# EAGLE design Xbee_shield_v15 (EAGLE 7.4.0)
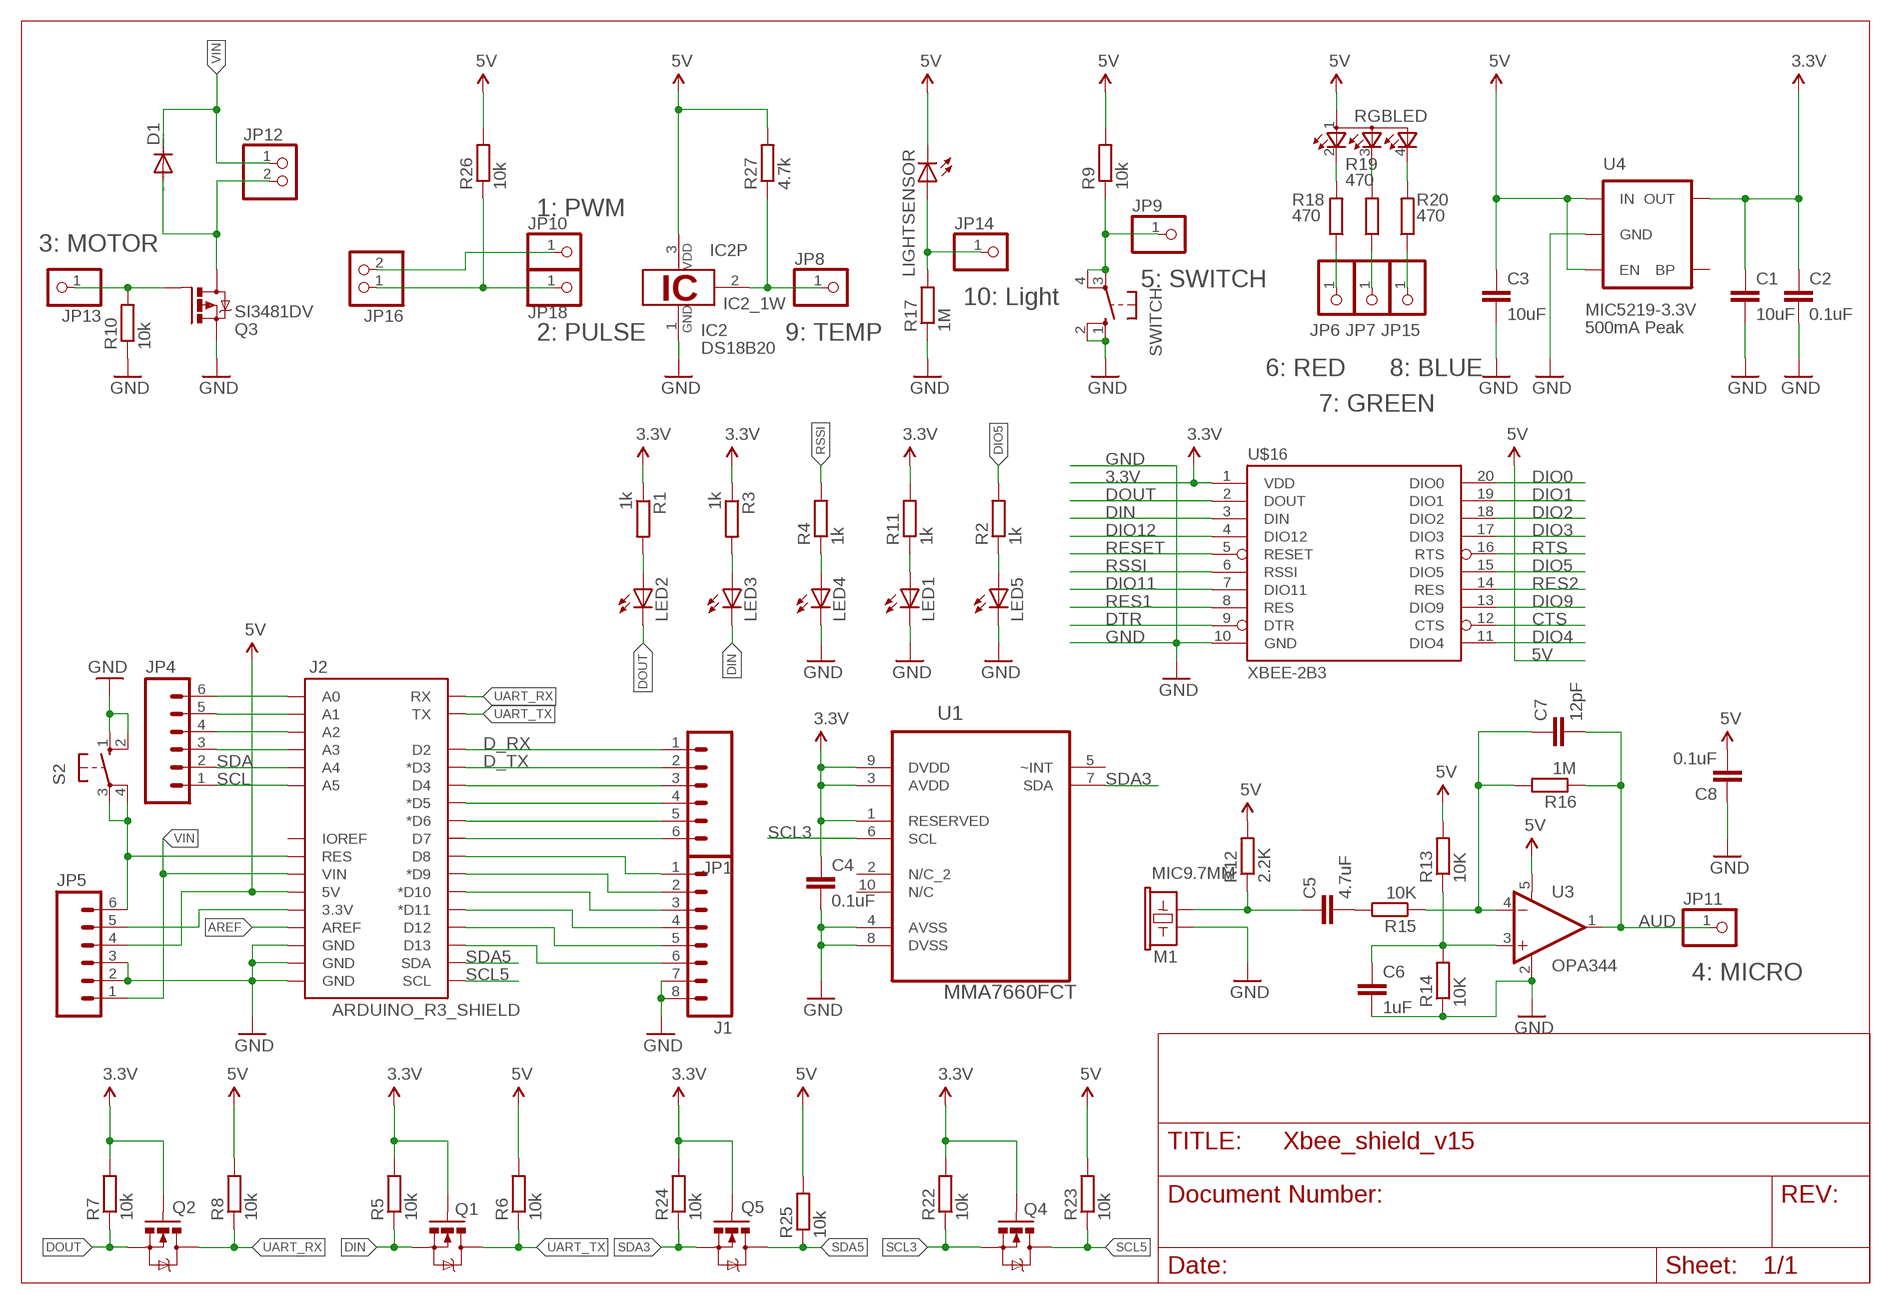
[diagram p0: schematic, sheet 1]

## Parts
C1  10uF  C-EUC0805  [C0805]
C2  0.1uF  C-EUC0805  [C0805]
C3  10uF  C-EUC0805  [C0805]
C4  0.1uF  C-EUC0805  [C0805]
C5  4.7uF  C-EUC0805  [C0805]
C6  1uF  C-EUC0805  [C0805]
C7  12pF  C-EUC0805  [C0805]
C8  0.1uF  C-EUC0805  [C0805]
D1  DIODE-DO214AA  [DO214AA]
IC2  DS18B20  [TO92-]
J1  M08  [1X08_ROUND]
J2  ARDUINO_R3_SHIELD  [UNO_R3_SHIELD]
JP1  M06SIP  [1X06]
JP4  M06SIP  [1X06]
JP5  M06SIP  [1X06]
JP6  PINHD-1X1  [1X01]
JP7  PINHD-1X1  [1X01]
JP8  PINHD-1X1  [1X01]
JP9  PINHD-1X1  [1X01]
JP10  PINHD-1X1  [1X01]
JP11  PINHD-1X1  [1X01]
JP12  PINHD-1X2  [1X02]
JP13  PINHD-1X1  [1X01]
JP14  PINHD-1X1  [1X01]
JP15  PINHD-1X1  [1X01]
JP16  PINHD-1X2  [1X02]
JP18  PINHD-1X1  [1X01]
LED1  LEDCHIPLED_0805  [CHIPLED_0805]
LED2  LEDCHIPLED_0805  [CHIPLED_0805]
LED3  LEDCHIPLED_0805  [CHIPLED_0805]
LED4  LEDCHIPLED_0805  [CHIPLED_0805]
LED5  LEDCHIPLED_0805  [CHIPLED_0805]
LIGHTSENSOR  LED5MM  [LED5MM]
M1  MIC9.7MM  [MIC-9.7MM]
Q1  MOSFET-NCHANNELSMD  [SOT23-3]
Q2  MOSFET-NCHANNELSMD  [SOT23-3]
Q3  SI3481DV  [TSOP-6.PAC]
Q4  MOSFET-NCHANNELSMD  [SOT23-3]
Q5  MOSFET-NCHANNELSMD  [SOT23-3]
R1  1k  R-EU_R0805  [R0805]
R2  1k  R-EU_R0805  [R0805]
R3  1k  R-EU_R0805  [R0805]
R4  1k  R-EU_R0805  [R0805]
R5  10k  R-EU_R0805  [R0805]
R6  10k  R-EU_R0805  [R0805]
R7  10k  R-EU_R0805  [R0805]
R8  10k  R-EU_R0805  [R0805]
R9  10k  R-EU_R0805  [R0805]
R10  10k  R-EU_R0805  [R0805]
R11  1k  R-EU_R0805  [R0805]
R12  2.2K  R-EU_R0805  [R0805]
R13  10K  R-EU_R0805  [R0805]
R14  10K  R-EU_R0805  [R0805]
R15  10K  R-EU_R0805  [R0805]
R16  1M  R-EU_R0805  [R0805]
R17  1M  R-EU_R0805  [R0805]
R18  470  R-EU_R0805  [R0805]
R19  470  R-EU_R0805  [R0805]
R20  470  R-EU_R0805  [R0805]
R22  10k  R-EU_R0805  [R0805]
R23  10k  R-EU_R0805  [R0805]
R24  10k  R-EU_R0805  [R0805]
R25  10k  R-EU_R0805  [R0805]
R26  10k  R-EU_R0805  [R0805]
R27  4.7k  R-EU_R0805  [R0805]
RGBLED  TOPLED-3  [P-LCC-4-3]
S2  10-XX  [B3F-10XX]
SWITCH  10-XX  [B3F-10XX]
U1  MMA7660FCT  [DFN300X300X100-10N]
U3  OPA344  [SOT23-5]
U4  V_REG_LDOSMD  [SOT23-5]
U$16  XBEE-2B3  [XBEE-SMD]

## Nets
3.3V: C1.1 C2.1 C4.1 Q1.1(G) Q2.1(G) Q4.1(G) Q5.1(G) R1.1 R3.1 R5.2 R7.2 R11.2 R22.2 R24.2 U1.1(RESERVED) U1.3(AVDD) U1.9(DVDD) U4.5(OUT) U$16.1(VDD)
5V: C3.1 C8.2 IC2.3 J2.5V JP5.4 LIGHTSENSOR.K(C) R6.2 R8.2 R9.2 R12.2 R13.2 R23.2 R25.2 R26.2 R27.2 RGBLED.1(A2) U3.5(V+) U4.1(IN) U4.3(EN)
AREF: J2.AREF
AUD: C7.2 JP11.1 R16.1 U3.1(OUT)
CTS: U$16.12(CTS)
D_RX: J2.D2 JP1.1
D_TX: J2.D3(*D3) JP1.2
DIN: LED3.C Q1.2(S) R5.1 U$16.3(DIN)
DIO0: U$16.20(DIO0)
DIO1: U$16.19(DIO1)
DIO2: U$16.18(DIO2)
DIO3: U$16.17(DIO3)
DIO4: U$16.11(DIO4)
DIO5: R2.2 U$16.15(DIO5)
DIO9: U$16.13(DIO9)
DIO11: U$16.7(DIO11)
DIO12: U$16.4(DIO12)
DOUT: LED2.C Q2.2(S) R7.1 U$16.2(DOUT)
DTR: U$16.9(DTR)
GND: C1.2 C2.2 C3.2 C4.2 C6.2 C8.1 IC2.1 J1.7 J1.8 J2.GND@0(GND) J2.GND@1(GND) J2.GND@2(GND) JP5.2 JP5.3 LED1.C LED4.C LED5.C M1.2 Q3.4(S) R10.1 R14.1 R17.1 S2.1(S) S2.2(S1) SWITCH.1(S) SWITCH.2(S1) U1.4(AVSS) U1.8(DVSS) U3.2(V-) U4.2(GND) U$16.10(GND)
N$1: LED2.A R1.2
N$2: LED4.A R4.1
N$3: J1.6 J2.D13
N$4: LED3.A R3.2
N$5: J2.A0 JP4.6
N$6: J2.A1 JP4.5
N$7: J2.A2 JP4.4
N$8: J2.RES JP5.6 S2.3(P) S2.4(P1)
N$9: JP9.1 R9.1 SWITCH.3(P) SWITCH.4(P1)
N$10: IC2.2 JP8.1 R27.1
N$11: JP10.1 JP16.2
N$13: C5.1 M1.1 R12.1
N$14: C7.1 R15.1 R16.2 U3.4(-IN)
N$15: C5.2 R15.2
N$16: C6.1 R13.1 R14.2 U3.3(+IN)
N$17: J1.1 J2.D8
N$18: J1.2 J2.D9(*D9)
N$19: JP13.1 Q3.3(G) R10.2
N$20: D1.A JP12.2 Q3.1(D) Q3.2(D) Q3.5(D) Q3.6(D)
N$21: JP14.1 LIGHTSENSOR.A R17.2
N$22: J2.A3 JP4.3
N$23: JP16.1 JP18.1 R26.1
N$25: J2.3.3V JP5.5
N$26: R18.2 RGBLED.2(CRED)
N$27: R19.2 RGBLED.3(CBLUE)
N$28: R20.2 RGBLED.4(CGREEN)
N$29: JP6.1 R18.1
N$30: J1.3 J2.D10(*D10)
N$31: JP7.1 R19.1
N$32: JP15.1 R20.1
N$38: LED1.A R11.1
N$43: J1.4 J2.D11(*D11)
N$55: J1.5 J2.D12
N$139: LED5.A R2.1
N$142: J2.D4 JP1.3
N$143: J2.D5(*D5) JP1.4
N$144: J2.D6(*D6) JP1.5
N$145: J2.D7 JP1.6
RES1: U$16.8(RES)
RES2: U$16.14(RES)
RESET: U$16.5(RESET)
RSSI: R4.2 U$16.6(RSSI)
RTS: U$16.16(RTS)
SCL: J2.A5 JP4.1
SCL3: Q4.2(S) R22.1 U1.6(SCL)
SCL5: J2.SCL Q4.3(D) R23.1
SDA: J2.A4 JP4.2
SDA3: Q5.2(S) R24.1 U1.7(SDA)
SDA5: J2.SDA Q5.3(D) R25.1
UART_RX: J2.RX Q2.3(D) R8.1
UART_TX: J2.TX Q1.3(D) R6.1
VIN: D1.C J2.VIN JP5.1 JP12.1
Unconnected: J2.IOREF U1.2(N/C_2) U1.5(~INT) U1.10(N/C) U4.4(BP)

## Notes on the sheet
- 1: PWM
- 3: MOTOR
- 5: SWITCH
- 10: Light
- MIC5219-3.3V
- 500mA Peak
- 2: PULSE | 9: TEMP
- 6: RED | 8: BLUE
- 7: GREEN
- 4: MICRO

## Library data of the parts
C1-C8 = rcl:C-EU: CAPACITOR, European symbol
D1 = diode:DIODE-: DIODE
IC2 = 1wire:DS18B20: Programmable Resolution Digital Thermometer This chip provides a onewire thermosensor with approx. 0.5°C accuracy. A programmable over/undertemperure alarm is available. The precision can be set from 9..12 bits. Notes: Vdd must be applied for accurate measurements at low temperatures, as the parasite power circuit otherwise heats the sensor. If parasite power is used, Vdd has to be connected to GND. The DS1822 is a low-cost thermometer chip, the DS18S20 is similar to the DS18B20, but with 9 Bit precision only. Author: Jan Kandziora <jjj@gmx.de>
J1 = SparkFun-Connectors:M08: Header 8 Standard 8-pin 0.1" header. Use with straight break away headers (SKU : PRT-00116), right angle break away headers (PRT-00553), swiss pins (PRT-00743), machine pins (PRT-00117), and female headers (PRT-00115).; PROD_ID: CONN-08437
J2 = SparkFun-Boards:ARDUINO_R3_SHIELD: Shield form compatible with the Arduino Uno R3.
JP1 JP4 JP5 = SparkFun:M06: Header 6 Standard 6-pin 0.1" header. Use with straight break away headers (SKU : PRT-00116), right angle break away headers (PRT-00553), swiss pins (PRT-00743), machine pins (PRT-00117), and female headers (PRT-00115). Molex polarized connector foot print use with SKU : PRT-08094 with associated crimp pins and housings. NOTES ON THE VARIANTS LOCK and LOCK_LONGPADS... This footprint was designed to help hold the alignment of a through-hole component (i.e. 6-pin header) while soldering it into place. You may notice that each hole has been shifted either up or down by 0.005 of an inch from it's more standard position (which is a perfectly straight line). This slight alteration caused the pins (the squares in the middle) to touch the edges of the holes. Because they are alternating, it causes a "brace" to hold the component in place. 0.005 has proven to be the perfect amount of "off-center" position when using our standard breakaway headers. Although looks a little odd when you look at the bare footprint, once you have a header in there, the alteration is very hard to notice. Also, if you push a header all the way into place, it is covered up entirely on the bottom side. This idea of altering the position of holes to aid alignment will be further integrated into the Sparkfun Library for other footprints. It can help hold any component with 3 or more connection pins.
JP6-JP11 JP13-JP15 JP18 = pinhead:PINHD-1X1: PIN HEADER
JP12 JP16 = pinhead:PINHD-1X2: PIN HEADER
LED1-LED5 LIGHTSENSOR = led:LED: LED OSRAM: - CHIPLED LG R971, LG N971, LY N971, LG Q971, LY Q971, LO R971, LY R971 LH N974, LH R974 LS Q976, LO Q976, LY Q976 LO Q996 - Hyper CHIPLED LW Q18S LB Q993, LB Q99A, LB R99A - SideLED LS A670, LO A670, LY A670, LG A670, LP A670 LB A673, LV A673, LT A673, LW A673 LH A674 LY A675 LS A676, LA A676, LO A676, LY A676, LW A676 LS A679, LY A679, LG A679 - Hyper Micro SIDELED® LS Y876, LA Y876, LO Y876, LY Y876 LT Y87S - SmartLED LW L88C, LW L88S LB L89C, LB L89S, LG L890 LS L89K, LO L89K, LY L89K LS L896, LA L896, LO L896, LY L896 - TOPLED LS T670, LO T670, LY T670, LG T670, LP T670 LSG T670, LSP T670, LSY T670, LOP T670, LYG T670 LG T671, LOG T671, LSG T671 LB T673, LV T673, LT T673, LW T673 LH T674 LS T676, LA T676, LO T676, LY T676, LB T676, LH T676, LSB T676, LW T676 LB T67C, LV T67C, LT T67C, LS T67K, LO T67K, LY T67K, LW E67C LS E67B, LA E67B, LO E67B, LY E67B, LB E67C, LV E67C, LT E67C LW T67C LS T679, LY T679, LG T679 LS T770, LO T770, LY T770, LG T770, LP T770 LB T773, LV T773, LT T773, LW T773 LH T774 LS E675, LA E675, LY E675, LS T675 LS T776, LA T776, LO T776, LY T776, LB T776 LHGB T686 LT T68C, LB T68C - Hyper Mini TOPLED® LB M676 - Mini TOPLED Santana® LG M470 LS M47K, LO M47K, LY M47K Source: http://www.osram.convergy.de LUXEON: - LUMILED® LXK2-PW12-R00, LXK2-PW12-S00, LXK2-PW14-U00, LXK2-PW14-V00 LXK2-PM12-R00, LXK2-PM12-S00, LXK2-PM14-U00 LXK2-PE12-Q00, LXK2-PE12-R00, LXK2-PE12-S00, LXK2-PE14-T00, LXK2-PE14-U00 LXK2-PB12-K00, LXK2-PB12-L00, LXK2-PB12-M00, LXK2-PB14-N00, LXK2-PB14-P00, LXK2-PB14-Q00 LXK2-PR12-L00, LXK2-PR12-M00, LXK2-PR14-Q00, LXK2-PR14-R00 LXK2-PD12-Q00, LXK2-PD12-R00, LXK2-PD12-S00 LXK2-PH12-R00, LXK2-PH12-S00 LXK2-PL12-P00, LXK2-PL12-Q00, LXK2-PL12-R00 Source: www.luxeon.com KINGBRIGHT: KA-3528ASYC Source: www.kingbright.com
M1 = SparkFun:MIC: Microphone Omni-directional electret microphone. 9.7mm standard diameter.
Q1 Q2 Q4 Q5 = SparkFun-DiscreteSemi:MOSFET-NCHANNEL: Generic NMOS footprint
Q3 = transistor-power:SI3481DV: P-Channel 30-V (D-S) MOSFET Source: http://www.vishay.com/docs/72105/72105.pdf
R1-R20 R22-R27 = rcl:R-EU_: RESISTOR, European symbol
RGBLED = ledEDIT:TOPLED-3: OSRAM - Hyper Multi TOPLED® (RGB) LB E673, LV E673, LT E673 - Power TOPLED® Enhanced optical Power LED (HOP2000) LS E67B, LA E67B, LO E67B, LY E67B - Hyper Multi TOPLED® Enhanced optical Power LED (HOP2000 / ATON®) LATB T66B - Hyper Multi TOPLED® Hyper-Bright LED LATB T686 Source: http://www.osram.convergy.de/
S2 SWITCH = switch-omron:10-XX: OMRON SWITCH; MPN: B3F-1000; OC_FARNELL: 176432; OC_NEWARK: 36M3542
U1 = Accelerometer:MMA7660FCT: Detection Sensor; MPN: MMA7660FCT; OC_FARNELL: 2238133; OC_NEWARK: 74P0443; PACKAGE: DFN-10; SUPPLIER: FREESCALE SEMICONDUCTOR
U3 = SparkFun:OPA344
U4 = SparkFun-PowerIC:V_REG_LDO: Voltage Regulator LDO Standard 150mA LDO voltage regulator in SOT-23 layout. Micrel part MIC5205. BP (by-pass) pin is used to lower output noise with 470pF cap.
U$16 = SparkFun-RF:XBEE-2: Xbee module footprints SMT header is CONN-09042.; PROD_ID: CONN-09042

## Net classes
0 default: width 0.203 mm
1 vcc: width 0.305 mm

## Board
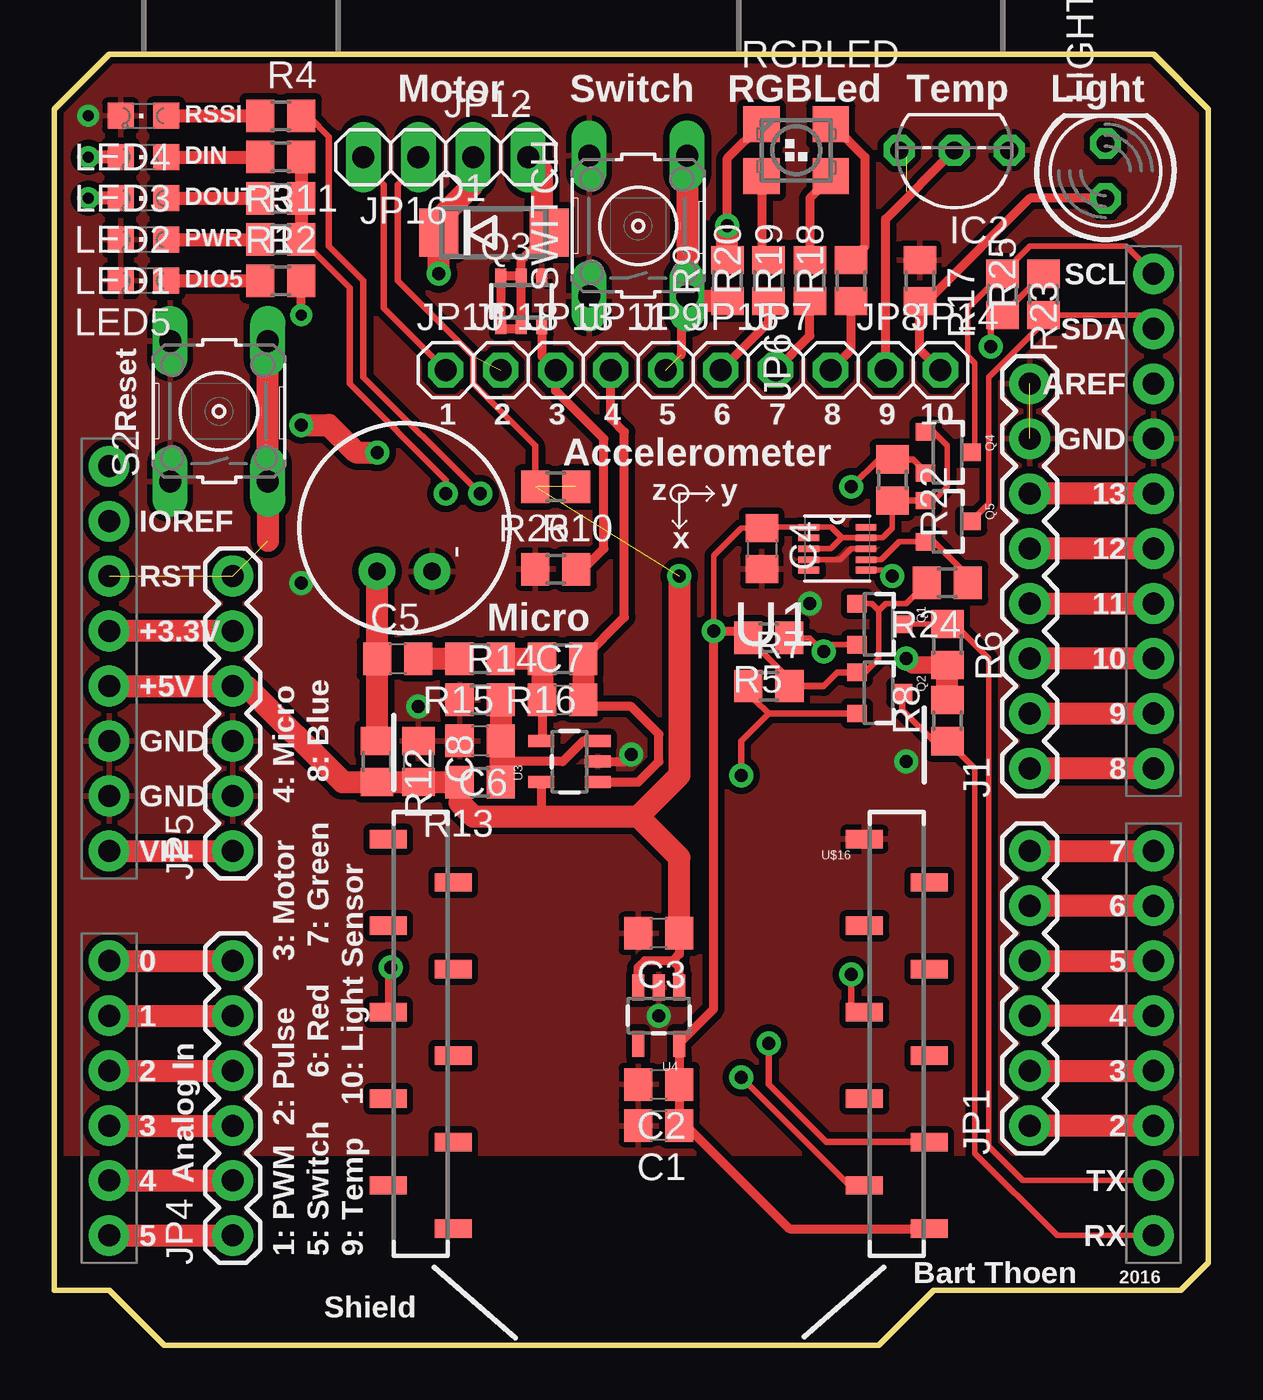
[diagram p1: board, top side]
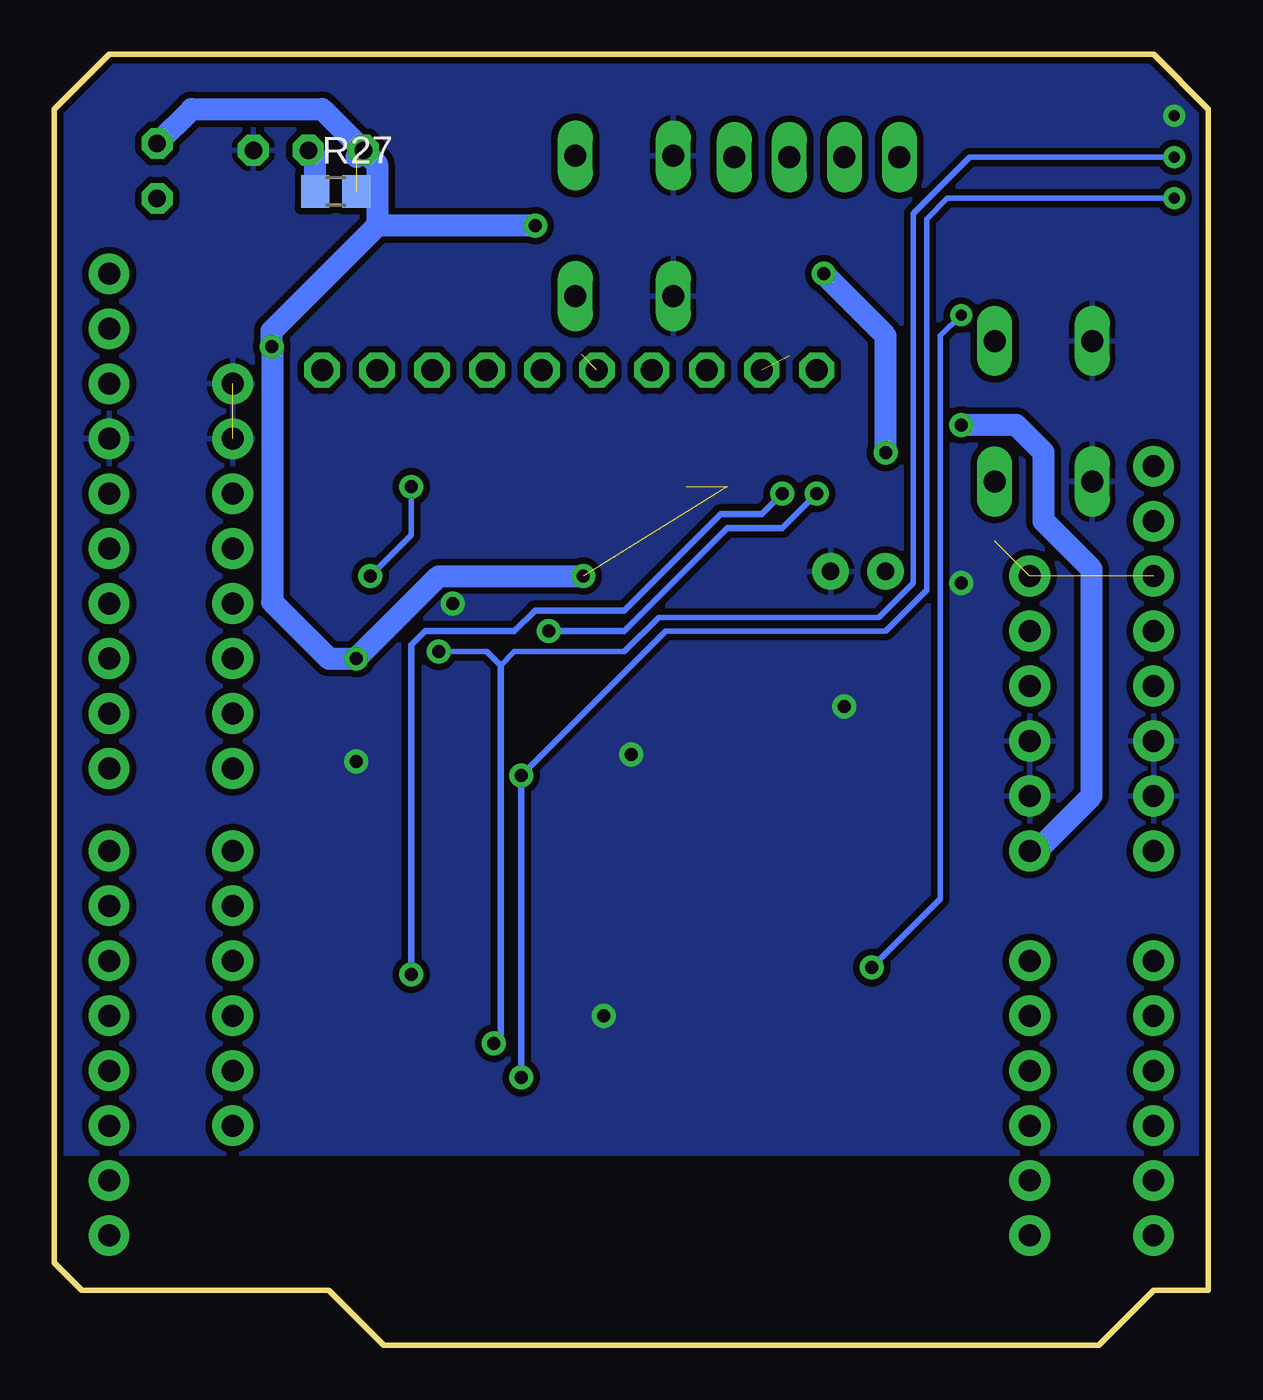
[diagram p2: board, bottom side, seen from below]

Size 53.34 x 59.69 mm. Coordinates in mm from the lower left corner, seen from the top.
Outline: 0,2.54 0,57.15 2.54,59.69 50.8,59.69 53.34,57.15 53.34,3.81 52.07,2.54 40.64,2.54 38.1,0 5.08,0 2.54,2.54 0,2.54
Copper layers (1*16): Top 0.035mm / dielectric 1.5mm / Bottom 0.035mm
Design rules "SparkFun-2-layer": minimum track width 7mil, minimum drill 15mil, track to track 8mil, track to pad 8mil, pad to pad 8mil, via to via 8mil, smd to smd 8mil, copper to edge 8mil, drill to drill 8mil, minimum pad ring 12mil, minimum via ring 10mil, stop-mask expansion 4mil, vias tented up to drill 20mil, thermal gap 10mil

### Footprints (pad centres in the part's own frame; a part is rotated, then mirrored left to right if it is on the bottom)
C0805 = smd 1.3 x 1.5: 1 -0.95,0; 2 0.95,0
DO214AA = smd 1.8 x 2.2: A 2.55,0; C -2.55,0
TO92- = drill 0.813 octagon: 1 -2.54,0; 2 0,0; 3 2.54,0
1X08_ROUND = drill 1.016 pad 1.88: 1 0,0; 2 2.54,0; 3 5.08,0; 4 7.62,0; 5 10.16,0; 6 12.7,0; 7 15.24,0; 8 17.78,0
UNO_R3_SHIELD = drill 1.016 pad 1.88: 3.3V 50.8,26.67; 5V 50.8,29.21; A0 50.8,41.91; A1 50.8,44.45; A2 50.8,46.99; A3 50.8,49.53; A4 50.8,52.07; A5 50.8,54.61; AREF 2.54,15.24; D2 2.54,49.53; D3 2.54,46.99; D4 2.54,44.45; D5 2.54,41.91; D6 2.54,39.37; D7 2.54,36.83; D8 2.54,33.02; D9 2.54,30.48; D10 2.54,27.94; D11 2.54,25.4; D12 2.54,22.86; D13 2.54,20.32; GND@0 50.8,31.75; GND@1 50.8,34.29; GND@2 2.54,17.78; IOREF 50.8,21.59; NC 50.8,19.05; RES 50.8,24.13; RX 2.54,54.61; SCL 2.54,10.16; SDA 2.54,12.7; TX 2.54,52.07; VIN 50.8,36.83
1X06 = drill 1.016 pad 1.88: 1 0,0; 2 2.54,0; 3 5.08,0; 4 7.62,0; 5 10.16,0; 6 12.7,0
1X01 = drill 1.016 octagon: 1 0,0
1X02 = drill 1.016 long: 1 -1.27,0; 2 1.27,0
CHIPLED_0805 = smd 1.2 x 1.2: A 0,-1.05; C 0,1.05
LED5MM = drill 0.813 octagon: A -1.27,0; K 1.27,0
MIC-9.7MM = drill 0.8 pad 1.676: 1 -2,1.27; 2 -2,-1.27
SOT23-3 = smd 0.8 x 0.9: 1 -0.95,-1; 2 0.95,-1; 3 0,1.1
TSOP-6.PAC = smd 0.508 x 0.7: 1 -0.95,-1.163; 2 0,-1.163; 3 0.95,-1.163; 4 0.95,1.163; 5 0,1.163; 6 -0.95,1.163
R0805 = smd 1.3 x 1.5: 1 -0.95,0; 2 0.95,0
P-LCC-4-3 = smd 1.676 x 1.676: 1 -1.2,-1.6; 2 -1.2,1.6; 3 1.2,1.6; 4 1.2,-1.6
B3F-10XX = drill 1.016 long: 1 -3.251,2.261; 2 3.251,2.261; 3 -3.251,-2.261; 4 3.251,-2.261
DFN300X300X100-10N = smd 0.965 x 0.305: 1 -1.321,0.991; 2 -1.321,0.508; 3 -1.321,0; 4 -1.321,-0.508; 5 -1.321,-0.991; 6 1.321,-0.991; 7 1.321,-0.508; 8 1.321,0; 9 1.321,0.508; 10 1.321,0.991
SOT23-5 = smd 0.55 x 1.2: 1 -0.95,-1.3; 2 0,-1.3; 3 0.95,-1.3; 4 0.95,1.3; 5 -0.95,1.3
XBEE-SMD = smd 1.7 x 0.85: 1 -12.5,20; 2 -9.5,18; 3 -12.5,16; 4 -9.5,14; 5 -12.5,12; 6 -9.5,10; 7 -12.5,8; 8 -9.5,6; 9 -12.5,4; 10 -9.5,2; 11 12.5,2; 12 9.5,4; 13 12.5,6; 14 9.5,8; 15 12.5,10; 16 9.5,12; 17 12.5,14; 18 9.5,16; 19 12.5,18; 20 9.5,20

### Placement (x,y rotation side)
C1  27.94,10.16 180 top
C2  27.94,12.06 180 top
C3  27.94,19.05 180 top
C4  32.7,36.83 270 top
C5  15.88,31.75 0 top
C6  19.68,27.94 180 top
C7  23.5,29.84 0 top
C8  16.83,26.99 270 top
D1  20.32,51.44 0 top
IC2  41.59,55.24 180 top
J1  45.09,26.67 90 top
J2  53.34,59.69 180 top
JP1  45.09,10.16 90 top
JP4  8.26,5.08 90 top
JP5  8.26,22.86 90 top
JP6  35.88,45.09 90 top
JP7  33.34,45.09 0 top
JP8  38.42,45.09 0 top
JP9  28.26,45.09 0 top
JP10  18.1,45.09 0 top
JP11  25.72,45.09 0 top
JP12  20.64,54.93 0 top
JP13  23.18,45.09 0 top
JP14  40.96,45.09 0 top
JP15  30.8,45.09 0 top
JP16  15.56,54.93 180 top
JP18  20.64,45.09 0 top
LED1  4.13,51.12 90 top
LED2  4.13,53.02 90 top
LED3  4.13,54.93 90 top
LED4  4.13,56.83 90 top
LED5  4.13,49.21 90 top
LIGHTSENSOR  48.58,54.29 90 top
M1  16.19,37.78 90 top
Q1  38.1,33.34 270 top
Q2  38.1,30.16 270 top
Q3  21.59,48.26 0 top
Q4  41.27,41.27 270 top
Q5  41.27,38.1 270 top
R1  10.48,53.02 180 top
R2  10.48,49.21 0 top
R3  10.48,54.93 180 top
R4  10.48,56.83 0 top
R5  33.02,32.7 180 top
R6  41.27,32.4 270 top
R7  33.03,30.48 0 top
R8  41.27,28.88 90 top
R9  31.11,49.21 90 top
R10  23.18,35.88 0 top
R11  10.48,51.12 0 top
R12  14.92,26.99 270 top
R13  19.68,26.04 180 top
R14  19.68,29.84 0 top
R15  19.68,31.75 180 top
R16  23.5,31.75 180 top
R17  40.01,49.21 270 top
R18  36.83,49.21 90 top
R19  34.92,49.21 90 top
R20  33.02,49.21 90 top
R22  38.73,40.01 270 top
R23  43.81,48.58 270 top
R24  41.27,35.24 180 top
R25  45.72,48.58 90 top
R26  23.18,39.69 180 top
R27  40.32,53.34 0 bottom
RGBLED  34.29,55.24 270 top
S2  7.62,43.18 90 top
SWITCH  26.99,51.75 90 top
U1  36.2,36.83 0 top
U3  23.81,26.99 90 top
U4  27.94,15.24 180 top
U$16  27.94,25.4 180 top

### Tracks (layer width: path | path; a pad name or v marks a point on that pad's centre or on a via)
3.3V  (via drill 0.6)
  Top 0.254: Q2.1 37.46,31.11 38.1,31.75 38.1,33.97 | Q4.1 40.64,42.23 41.27,41.59 41.27,39.69 40.64,39.05 Q5.1 | 33.3,37.82 U1.1 35.9,37.82 36.39,37.34 | U1.3 35.88,36.83 36.39,37.34 | 36.39,37.34 U1.9 38.29,37.34 38.73,37.78 R22.2 | Q1.1 37.78,34.29 38.1,33.97 | 38.1,33.97 38.42,34.29 39.37,34.29 R24.2 | C4.1 31.75,37.78 30.48,36.51 v30.48,33.02 | 33.98,30.79 R7.2
  Top 0.305: Q2.1 36.19,31.11 35.56,30.48 R7.2 | Q5.1 R22.2 | 11.75,50.8 13.65,48.9 13.65,44.45 18.1,40.01 v18.1,39.37 | R5.2 33.98,30.79 | C4.1 | U$16.1
  Top 0.406: C1.1 C2.1 U4.5 28.86,13.94 30.48,15.56 v30.48,33.02 32.07,33.02 R5.2 | C1.1 | C1.1 29.21,10.16 33.97,5.4 U$16.1 | 33.3,37.82 32.74,37.82 C4.1 | 11.75,50.8 11.74,50.8 R11.2
  Top 0.61: R3.1 R1.1 R11.2
  Bottom 0.305: v18.1,39.37 19.68,37.78 22.23,37.78 26.99,33.02 v30.48,33.02
5V  (via drill 0.6)  (2 unrouted)
  Top 0.254: R25.2 R23.2 43.5,47.31
  Top 0.305: v43.28,46.16 43.28,47.1 R23.2
  Top 0.406: U4.1 28.89,17.46 28.57,17.78 | 28.57,17.78 27.3,17.78 26.99,17.46 U4.3 | 28.57,17.78 28.89,18.09 C3.1 | v31.11,51.75 31.11,54.87 RGBLED.1 | U3.5 22.51,24.8 22.86,24.45
  Top 0.813: R6.2 39.67,31.45 v39.37,31.75
  Top 1.016: R9.2 v31.11,51.75 | R8.2 R6.2 | J2.5V JP5.4 8.89,30.48 13.34,26.04 R12.2 C8.2 R13.2 18.73,25.08 19.37,24.45 22.86,24.45 26.99,24.45 | v28.89,35.56 28.89,26.35 26.99,24.45 | 26.99,24.45 28.89,22.55 C3.1
  Bottom 1.016: LIGHTSENSOR.K 46.99,57.15 40.96,57.15 IC2.3 | v28.89,35.56 35.56,35.56 v39.37,31.75 40.64,31.75 43.26,34.37 43.26,46.16 v43.28,46.16 43.28,46.89 38.42,51.75 | IC2.3 38.42,54.61 38.42,51.75 | v31.11,51.75 38.42,51.75 | 39.37,54.92 IC2.3
AUD
  Top 0.406: U3.1 26.99,26.04 27.94,26.99 27.94,28.26 26.67,29.53 24.76,29.53 C7.2 | JP11.1 25.72,42.86 26.35,42.23 26.35,33.66 R16.1
  Top 1.016: R16.1 C7.2
D_RX
  Top 1.016: J2.D2 JP1.1
D_TX
  Top 1.016: JP1.2 J2.D3
DIN  (via drill 0.51, 0.6)
  Top 0.254: Q1.2 35.88,32.39 v35.56,32.07 34.92,32.7 R5.1
  Top 0.305: v33.02,13.97 33.02,12.06 35.69,9.4 U$16.3
  Top 0.61: LED3.C v1.59,54.93
  Bottom 0.254: v1.59,54.93 11.04,54.93 13.65,52.31 13.65,35.24 15.24,33.66 25.4,33.66 26.99,32.07 32.07,32.07 32.7,31.43 33.34,32.07 v35.56,32.07
  Bottom 0.305: 32.7,31.43 32.7,14.29 v33.02,13.97
DIO5  (via drill 0.51, 0.6)
  Top 0.305: U$16.15 15.44,17.34 v15.56,17.46
  Top 0.406: v11.43,47.62 R2.2
  Top 0.61: R2.2
  Bottom 0.254: v11.43,47.62 12.38,46.67 12.38,20.64 v15.56,17.46
DOUT  (via drill 0.51, 0.6)
  Top 0.305: Q2.2 33.02,29.21 | 33.02,29.21 32.38,29.84 32.38,30.46 32.37,30.48 R7.1 | v31.75,26.35 31.75,27.95 33.02,29.21 | v31.75,12.38 36.73,7.4 U$16.2
  Top 0.61: LED2.C v1.59,53.02
  Bottom 0.254: v1.59,53.02 12.06,53.02 13.02,52.07 13.02,34.92 14.92,33.02 25.08,33.02 v31.75,26.35
  Bottom 0.305: v31.75,12.38 v31.75,26.35
GND  (via drill 0.51, 0.6)  (1 unrouted)
  Top 0.254: U1.8 36.83,36.83 36.32,36.32 U1.4
  Top 0.406: U3.2 26.35,26.99 v26.67,27.3
  other vias: 1.59,56.83 27.94,15.24 16.83,29.53 39.37,26.99 34.92,34.29 11.43,35.24
  pour Top (isolate 0.305): 0,8.89 0,59.69 53.34,59.69 53.34,8.89
  pour Bottom (isolate 0.305): 0,59.69 0,8.89 53.34,8.89 53.34,59.69
N$1
  Top 0.61: LED2.A R1.2
N$2
  Top 0.61: LED4.A R4.1
N$3
  Top 1.016: J2.D13 J1.6
N$4
  Top 0.61: LED3.A R3.2
N$5
  Top 1.016: J2.A0 JP4.6
N$6
  Top 1.016: J2.A1 JP4.5
N$7
  Top 1.016: J2.A2 JP4.4
N$8  (2 unrouted)
  Top 1.016: S2.4 S2.3 9.88,37.19
N$9  (1 unrouted)
  Top 0.406: 28.97,48.46 28.97,45.8
  Top 1.016: SWITCH.4 SWITCH.3 28.97,48.5 28.97,48.46 29.17,48.26 R9.1
N$10
  Top 0.406: JP8.1 38.42,52.07 IC2.2
  Bottom 1.016: R27.1 41.27,54.92 IC2.2
N$11
  Top 0.305: JP16.2 14.29,54.61 15.24,53.66 15.24,47.94 JP10.1
N$13
  Top 1.016: R12.1 C5.1 | C5.1 | C5.1 M1.1
N$14
  Top 0.406: C7.1 22.55,27.97 U3.4
  Top 1.016: R15.1 R16.2 C7.1
N$15
  Top 1.016: C5.2 R15.2
N$16
  Top 0.406: U3.3 24.45,27.94 23.5,26.99 20.64,26.99
  Top 1.016: R13.1 20.64,26.99 C6.1 R14.2
N$17
  Top 1.016: J2.D8 J1.1
N$18
  Top 1.016: J1.2 J2.D9
N$19
  Top 0.406: Q3.3 22.54,45.72 JP13.1 23.18,44.13 25.4,41.91 25.4,36.83 24.45,35.88 R10.2
N$20
  Top 0.406: Q3.5 Q3.6 | Q3.6 20.64,49.53 | Q3.6 20.64,46.99 21.59,46.99 21.59,50.16 D1.A
  Top 1.016: JP12.2 22.54,54.29 22.54,51.76 D1.A
N$21
  Top 0.406: JP14.1 40.01,46.04 R17.2 | LIGHTSENSOR.A 45.09,53.02 40.64,48.58 40.32,48.58 R17.2 | R17.2
N$22
  Top 1.016: J2.A3 JP4.3
N$23  (2 unrouted)
  Top 0.305: JP16.1 16.83,54.61 15.88,53.66 15.88,49.21 19.37,45.72 19.37,44.45 22.23,41.59 22.23,39.69
N$25
  Top 1.016: JP5.5 J2.3.3V
N$26
  Top 0.406: RGBLED.2 35.95,56.45 37.47,54.93 37.47,50.8 R18.2
N$27
  Top 0.406: RGBLED.3 35.89,53.99 34.92,53.02 R19.2
N$28
  Top 0.406: RGBLED.4 32.69,50.49 R20.2
N$29
  Top 0.406: JP6.1 36.83,46.04 R18.1
N$30
  Top 1.016: J2.D10 J1.3
N$31
  Top 0.406: JP7.1 34.92,46.67 R19.1
N$32
  Top 0.406: JP15.1 33.02,47.31 R20.1
N$38
  Top 0.61: LED1.A R11.1
N$43
  Top 1.016: J1.4 J2.D11
N$55
  Top 1.016: J2.D12 J1.5
N$139
  Top 0.61: LED5.A R2.1
N$142
  Top 1.016: J2.D4 JP1.3
N$143
  Top 1.016: JP1.4 J2.D5
N$144
  Top 1.016: J2.D6 JP1.5
N$145
  Top 1.016: JP1.6 J2.D7
RSSI  (via drill 0.6)
  Top 0.305: R4.2 11.49,56.77 11.81,56.77 12.7,55.88 12.7,50.8 14.29,49.21 14.29,44.77 v19.68,39.37 | v36.83,17.14 36.83,15.56 37.28,15.56 U$16.6
  Bottom 0.305: v19.68,39.37 20.64,38.42 22.54,38.42 26.99,33.97 31.11,33.97 32.07,33.02 36.2,33.02 36.83,32.38 v36.83,17.14
SCL
  Top 1.016: J2.A5 JP4.1
SCL3  (via drill 0.6)
  Top 0.254: U1.6 38.46,35.84 v38.73,35.56 | R22.1 | Q4.2
  Top 0.305: Q4.2 40.27,40.37 39.69,40.96 R22.1 38.1,40.95 v36.83,39.69
  Bottom 0.254: v36.83,39.69 36.83,37.47 v38.73,35.56
SCL5
  Top 0.254: J2.SCL 49.53,50.8 45.09,50.8 R23.1 43.49,49.53 43.49,49.21 42.23,47.94 42.23,45.72 42.55,45.4 42.55,41.45 Q4.3
  Top 1.016: R23.1
SDA
  Top 1.016: J2.A4 JP4.2
SDA3
  Top 0.254: U1.7 38.23,36.32 39.05,37.15 Q5.2 40.64,37.15 41.91,35.88 41.91,35.56 R24.1
SDA5
  Top 0.254: J2.SDA 50.16,47.63 R25.1 45.72,47.31 43.18,44.77 43.18,38.91 Q5.3
UART_RX
  Top 0.254: J2.RX 46.35,5.08 42.55,8.89 42.55,26.67 42.53,26.67 R8.1
  Top 0.305: Q2.3 39.2,29.38 40.64,27.94 R8.1
  Top 0.813: R8.1
UART_TX
  Top 0.254: J2.TX 44.77,7.62 43.18,9.21 43.18,31.75 41.91,33.02 41.6,33.02 R6.1 41.27,33.34 Q1.3
VIN  (via drill 0.6)
  Top 1.016: v11.43,42.55 12.7,42.55 13.97,41.27 v14.92,41.27 | J2.VIN JP5.1 | JP12.1 19.37,53.66 17.78,52.07 D1.C 17.78,51.42 v17.78,49.53
  Bottom 1.016: JP5.1 7.94,22.86 5.4,25.4 5.4,35.88 7.62,38.1 7.62,41.27 8.89,42.55 v11.43,42.55 | v14.92,41.27 14.92,46.67 v17.78,49.53

### Text on the board
tPlace: RSSI | Motor | - | Switch | RGBLed | Temp | Light | DIN | DOUT | PWR | DIO5 | 1 | 2 | 3 | 4 | 5 | 6 | 7 | 8 | 9 | 10 | Reset | Accelerometer | z | y | x | Micro | 8: Blue | 4: Micro | 3: Motor | 7: Green | 6: Red | 10: Light Sensor | 2: Pulse | 1: PWM | 5: Switch | 9: Temp | Bart Thoen | 2016 | Shield